# Altium schematic sheet DDR3_Power_Termination.SchDoc
size A3; DocumentNumber: 15; SheetNumber: 15; SheetTotal: 47
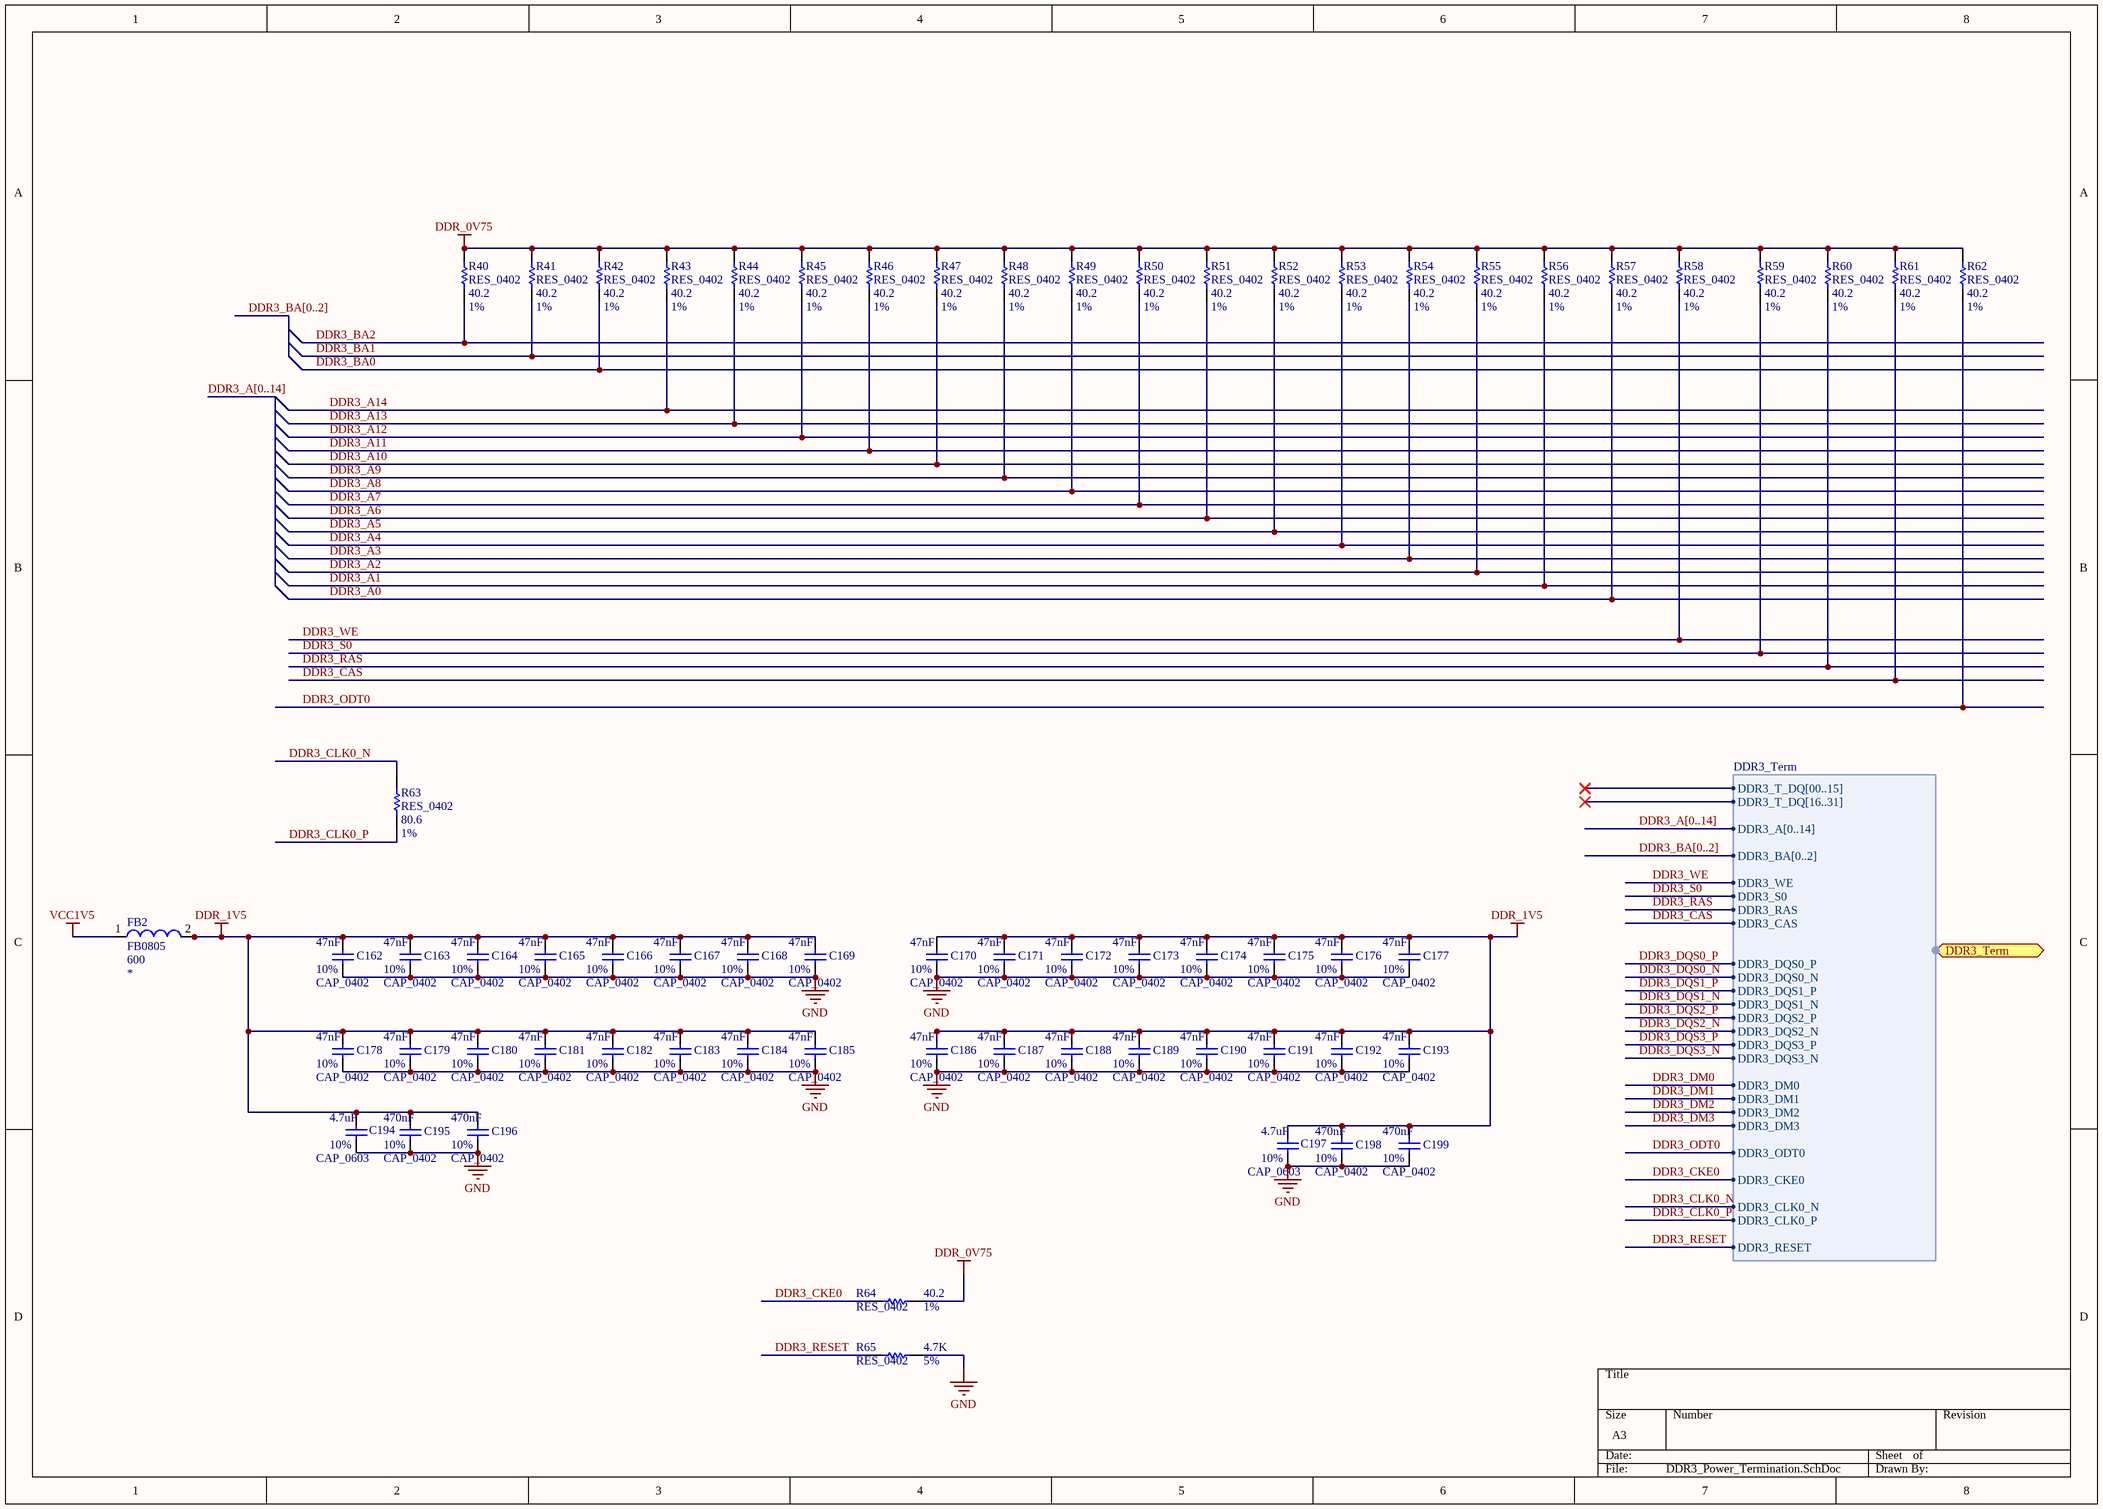
[diagram p0: DDR3_Power_Termination.SchDoc]

## Parts
C162  CAP_0402  value 47nF  Tolerance: 10%  [CAPC0402(1005)60_N]
C163  CAP_0402  value 47nF  Tolerance: 10%  [CAPC0402(1005)60_N]
C164  CAP_0402  value 47nF  Tolerance: 10%  [CAPC0402(1005)60_N]
C165  CAP_0402  value 47nF  Tolerance: 10%  [CAPC0402(1005)60_N]
C166  CAP_0402  value 47nF  Tolerance: 10%  [CAPC0402(1005)60_N]
C167  CAP_0402  value 47nF  Tolerance: 10%  [CAPC0402(1005)60_N]
C168  CAP_0402  value 47nF  Tolerance: 10%  [CAPC0402(1005)60_N]
C169  CAP_0402  value 47nF  Tolerance: 10%  [CAPC0402(1005)60_N]
C170  CAP_0402  value 47nF  Tolerance: 10%  [CAPC0402(1005)60_N]
C171  CAP_0402  value 47nF  Tolerance: 10%  [CAPC0402(1005)60_N]
C172  CAP_0402  value 47nF  Tolerance: 10%  [CAPC0402(1005)60_N]
C173  CAP_0402  value 47nF  Tolerance: 10%  [CAPC0402(1005)60_N]
C174  CAP_0402  value 47nF  Tolerance: 10%  [CAPC0402(1005)60_N]
C175  CAP_0402  value 47nF  Tolerance: 10%  [CAPC0402(1005)60_N]
C176  CAP_0402  value 47nF  Tolerance: 10%  [CAPC0402(1005)60_N]
C177  CAP_0402  value 47nF  Tolerance: 10%  [CAPC0402(1005)60_N]
C178  CAP_0402  value 47nF  Tolerance: 10%  [CAPC0402(1005)60_N]
C179  CAP_0402  value 47nF  Tolerance: 10%  [CAPC0402(1005)60_N]
C180  CAP_0402  value 47nF  Tolerance: 10%  [CAPC0402(1005)60_N]
C181  CAP_0402  value 47nF  Tolerance: 10%  [CAPC0402(1005)60_N]
C182  CAP_0402  value 47nF  Tolerance: 10%  [CAPC0402(1005)60_N]
C183  CAP_0402  value 47nF  Tolerance: 10%  [CAPC0402(1005)60_N]
C184  CAP_0402  value 47nF  Tolerance: 10%  [CAPC0402(1005)60_N]
C185  CAP_0402  value 47nF  Tolerance: 10%  [CAPC0402(1005)60_N]
C186  CAP_0402  value 47nF  Tolerance: 10%  [CAPC0402(1005)60_N]
C187  CAP_0402  value 47nF  Tolerance: 10%  [CAPC0402(1005)60_N]
C188  CAP_0402  value 47nF  Tolerance: 10%  [CAPC0402(1005)60_N]
C189  CAP_0402  value 47nF  Tolerance: 10%  [CAPC0402(1005)60_N]
C190  CAP_0402  value 47nF  Tolerance: 10%  [CAPC0402(1005)60_N]
C191  CAP_0402  value 47nF  Tolerance: 10%  [CAPC0402(1005)60_N]
C192  CAP_0402  value 47nF  Tolerance: 10%  [CAPC0402(1005)60_N]
C193  CAP_0402  value 47nF  Tolerance: 10%  [CAPC0402(1005)60_N]
C194  CAP_0603  value 4.7uF  Tolerance: 10%  [CAPC0603(1608)100_N]
C195  CAP_0402  value 470nF  Tolerance: 10%  [CAPC0402(1005)60_N]
C196  CAP_0402  value 470nF  Tolerance: 10%  [CAPC0402(1005)60_N]
C197  CAP_0603  value 4.7uF  Tolerance: 10%  [CAPC0603(1608)100_N]
C198  CAP_0402  value 470nF  Tolerance: 10%  [CAPC0402(1005)60_N]
C199  CAP_0402  value 470nF  Tolerance: 10%  [CAPC0402(1005)60_N]
FB2  FB0805  Resistance: 600  [Inductor0805(2012)]
R40  RES_0402  value 40.2  Tolerance: 1%  [RESC0402(1005)_N]
R41  RES_0402  value 40.2  Tolerance: 1%  [RESC0402(1005)_N]
R42  RES_0402  value 40.2  Tolerance: 1%  [RESC0402(1005)_N]
R43  RES_0402  value 40.2  Tolerance: 1%  [RESC0402(1005)_N]
R44  RES_0402  value 40.2  Tolerance: 1%  [RESC0402(1005)_N]
R45  RES_0402  value 40.2  Tolerance: 1%  [RESC0402(1005)_N]
R46  RES_0402  value 40.2  Tolerance: 1%  [RESC0402(1005)_N]
R47  RES_0402  value 40.2  Tolerance: 1%  [RESC0402(1005)_N]
R48  RES_0402  value 40.2  Tolerance: 1%  [RESC0402(1005)_N]
R49  RES_0402  value 40.2  Tolerance: 1%  [RESC0402(1005)_N]
R50  RES_0402  value 40.2  Tolerance: 1%  [RESC0402(1005)_N]
R51  RES_0402  value 40.2  Tolerance: 1%  [RESC0402(1005)_N]
R52  RES_0402  value 40.2  Tolerance: 1%  [RESC0402(1005)_N]
R53  RES_0402  value 40.2  Tolerance: 1%  [RESC0402(1005)_N]
R54  RES_0402  value 40.2  Tolerance: 1%  [RESC0402(1005)_N]
R55  RES_0402  value 40.2  Tolerance: 1%  [RESC0402(1005)_N]
R56  RES_0402  value 40.2  Tolerance: 1%  [RESC0402(1005)_N]
R57  RES_0402  value 40.2  Tolerance: 1%  [RESC0402(1005)_N]
R58  RES_0402  value 40.2  Tolerance: 1%  [RESC0402(1005)_N]
R59  RES_0402  value 40.2  Tolerance: 1%  [RESC0402(1005)_N]
R60  RES_0402  value 40.2  Tolerance: 1%  [RESC0402(1005)_N]
R61  RES_0402  value 40.2  Tolerance: 1%  [RESC0402(1005)_N]
R62  RES_0402  value 40.2  Tolerance: 1%  [RESC0402(1005)_N]
R63  RES_0402  value 80.6  Tolerance: 1%  [RESC0402(1005)_N]
R64  RES_0402  value 40.2  Tolerance: 1%  [RESC0402(1005)_N]
R65  RES_0402  value 4.7K  Tolerance: 5%  [RESC0402(1005)_N]

## Ports
DDR3_Term (harness DDR3_Term)

## Harnesses
DDR3_Term: DDR3_T_DQ[00..15], DDR3_T_DQ[16..31], DDR3_A[0..14], DDR3_BA[0..2], DDR3_WE, DDR3_S0, DDR3_RAS, DDR3_CAS, DDR3_DQS0_P, DDR3_DQS0_N, DDR3_DQS1_P, DDR3_DQS1_N, DDR3_DQS2_P, DDR3_DQS2_N, DDR3_DQS3_P, DDR3_DQS3_N, DDR3_DM0, DDR3_DM1, DDR3_DM2, DDR3_DM3, DDR3_ODT0, DDR3_CKE0, DDR3_CLK0_N, DDR3_CLK0_P, DDR3_RESET

## Nets
DDR_0V75: R40.2 R41.2 R42.2 R43.2 R44.2 R45.2 R46.2 R47.2 R48.2 R49.2 R50.2 R51.2 R52.2 R53.2 R54.2 R55.2 R56.2 R57.2 R58.2 R59.2 R60.2 R61.2 R62.2 R64.2
DDR_1V5: C162.2 C163.2 C164.2 C165.2 C166.2 C167.2 C168.2 C169.2 C170.2 C171.2 C172.2 C173.2 C174.2 C175.2 C176.2 C177.2 C178.2 C179.2 C180.2 C181.2 C182.2 C183.2 C184.2 C185.2 C186.2 C187.2 C188.2 C189.2 C190.2 C191.2 C192.2 C193.2 C194.2 C195.2 C196.2 C197.2 C198.2 C199.2 FB2.2
GND: C162.1 C163.1 C164.1 C165.1 C166.1 C167.1 C168.1 C169.1 C170.1 C171.1 C172.1 C173.1 C174.1 C175.1 C176.1 C177.1 C178.1 C179.1 C180.1 C181.1 C182.1 C183.1 C184.1 C185.1 C186.1 C187.1 C188.1 C189.1 C190.1 C191.1 C192.1 C193.1 C194.1 C195.1 C196.1 C197.1 C198.1 C199.1 R65.2
VCC1V5: FB2.1
DDR3_A0: R57.1
DDR3_A1: R56.1
DDR3_A2: R55.1
DDR3_A3: R54.1
DDR3_A4: R53.1
DDR3_A5: R52.1
DDR3_A6: R51.1
DDR3_A7: R50.1
DDR3_A8: R49.1
DDR3_A9: R48.1
DDR3_A10: R47.1
DDR3_A11: R46.1
DDR3_A12: R45.1
DDR3_A13: R44.1
DDR3_A14: R43.1
DDR3_BA0: R42.1
DDR3_BA1: R41.1
DDR3_BA2: R40.1
DDR3_CAS: R61.1 ; port DDR3_Term.DDR3_CAS
DDR3_CKE0: R64.1 ; port DDR3_Term.DDR3_CKE0
DDR3_CLK0_N: R63.2 ; port DDR3_Term.DDR3_CLK0_N
DDR3_CLK0_P: R63.1 ; port DDR3_Term.DDR3_CLK0_P
DDR3_DM0: port DDR3_Term.DDR3_DM0
DDR3_DM1: port DDR3_Term.DDR3_DM1
DDR3_DM2: port DDR3_Term.DDR3_DM2
DDR3_DM3: port DDR3_Term.DDR3_DM3
DDR3_DQS0_N: port DDR3_Term.DDR3_DQS0_N
DDR3_DQS0_P: port DDR3_Term.DDR3_DQS0_P
DDR3_DQS1_N: port DDR3_Term.DDR3_DQS1_N
DDR3_DQS1_P: port DDR3_Term.DDR3_DQS1_P
DDR3_DQS2_N: port DDR3_Term.DDR3_DQS2_N
DDR3_DQS2_P: port DDR3_Term.DDR3_DQS2_P
DDR3_DQS3_N: port DDR3_Term.DDR3_DQS3_N
DDR3_DQS3_P: port DDR3_Term.DDR3_DQS3_P
DDR3_ODT0: R62.1 ; port DDR3_Term.DDR3_ODT0
DDR3_RAS: R60.1 ; port DDR3_Term.DDR3_RAS
DDR3_RESET: R65.1 ; port DDR3_Term.DDR3_RESET
DDR3_S0: R59.1 ; port DDR3_Term.DDR3_S0
DDR3_WE: R58.1 ; port DDR3_Term.DDR3_WE

## Buses and harness runs
bus DDR3_A[0..14]
bus DDR3_BA[0..2]

## Library data of the parts
C162-C193 = CAP_0402: 0.047uF, ceramic, 10% 6.3V X5R, 0402; Part Number: GRM155R60J473KA01D; Manufacturer: Murata Electronics North America; Footprint Ref: CAPC0402(1005)60_N; Library Ref: CAP_0402
C194 C197 = CAP_0603: 4.7uF, ceramic, 10% 6.3V X5R Low ESR, 0603; Part Number: GRM188R60J475KE19D; Manufacturer: Murata Electronics North America; Footprint Ref: CAPC0603(1608)100_N; Library Ref: CAP_0603
C195 C196 C198 C199 = CAP_0402: 0.47uF, ceramic, 10% 6.3V X5R, 0402; Part Number: GRM155R60J474KE19D; Manufacturer: Murata Electronics North America; Footprint Ref: CAPC0402(1005)60_N; Library Ref: CAP_0402
FB2 = FerriteBead0805: MPZ2012S601A, 600 ohm, 100MHz, 0805; Manufacturer: TDK Corporation; Value: 600; Max_Current: *; Part Number: MPZ2012S601A; Footprint Ref: Inductor0805(2012); Library Ref: FerriteBead0805
R40-R62 R64 = RES_0402: 40.2 ohm, 1% 1/16W, 0402; Part Number: RMCF0402FT40R2; Manufacturer: Stackpole Electronics; Library Ref: RES_0402; Footprint Ref: RESC0402(1005)_N
R63 = RES_0402: 80.6 ohm, 1% 1/16W, 0402; Part Number: RMCF0402FT80R6; Manufacturer: Stackpole Electronics; Library Ref: RES_0402; Footprint Ref: RESC0402(1005)_N
R65 = RES_0402: 4.7K ohm, 5%, 1/16W, 0402; Part Number: RC0402JR-074K7L; Manufacturer: Yageo America; Library Ref: RES_0402; Footprint Ref: RESC0402(1005)_N